# Altium schematic sheet CartePuissance.SchDoc
size A4 portrait; PageSetup: Record=PageOptions|CenterHorizontal=True|CenterVertical=True|PrintScale=1.00|XCorrection=1.00|YCorrection=1.00|PrintKind=1|BorderSize=5000000|LeftOffset=0|BottomOffset=0|Orientation=1|PaperLength=1000|PaperWidth=1000|Scale=100|PaperSource=7|PrintQuality=-4|MediaType=1|DitherType=10|PaperKind=A3|PrintScaleMode=1
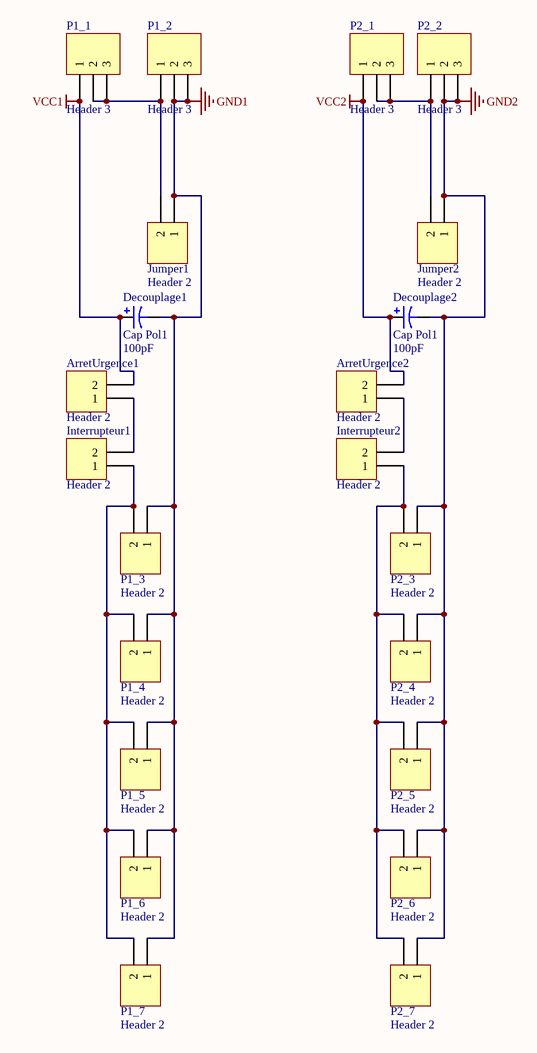
[diagram p0: CartePuissance.SchDoc]

## Parts
ArretUrgence1  Header 2  [HDR1X2]
ArretUrgence2  Header 2  [HDR1X2]
Decouplage1  Cap Pol1  value 100pF  [RB7.6-15]
Decouplage2  Cap Pol1  value 100pF  [RB7.6-15]
Interrupteur1  Header 2  [HDR1X2]
Interrupteur2  Header 2  [HDR1X2]
Jumper1  Header 2  [HDR1X2]
Jumper2  Header 2  [HDR1X2]
P1_1  Header 3  [HDR1X3]
P1_2  Header 3  [HDR1X3]
P1_3  Header 2  [HDR1X2]
P1_4  Header 2  [HDR1X2]
P1_5  Header 2  [HDR1X2]
P1_6  Header 2  [HDR1X2]
P1_7  Header 2  [HDR1X2]
P2_1  Header 3  [HDR1X3]
P2_2  Header 3  [HDR1X3]
P2_3  Header 2  [HDR1X2]
P2_4  Header 2  [HDR1X2]
P2_5  Header 2  [HDR1X2]
P2_6  Header 2  [HDR1X2]
P2_7  Header 2  [HDR1X2]

## Nets
GND1: Decouplage1.2 Jumper1.1 P1_2.2 P1_2.3 P1_3.1 P1_4.1 P1_5.1 P1_6.1 P1_7.1
GND2: Decouplage2.2 Jumper2.1 P2_2.2 P2_2.3 P2_3.1 P2_4.1 P2_5.1 P2_6.1 P2_7.1
VCC1: ArretUrgence1.2 Decouplage1.1 P1_1.1
VCC2: ArretUrgence2.2 Decouplage2.1 P2_1.1
NetArretUrgence1_1: ArretUrgence1.1 Interrupteur1.2
NetArretUrgence2_1: ArretUrgence2.1 Interrupteur2.2
NetInterrupteur1_1: Interrupteur1.1 P1_3.2 P1_4.2 P1_5.2 P1_6.2 P1_7.2
NetInterrupteur2_1: Interrupteur2.1 P2_3.2 P2_4.2 P2_5.2 P2_6.2 P2_7.2
NetJumper1_2: Jumper1.2 P1_1.2 P1_1.3 P1_2.1
NetJumper2_2: Jumper2.2 P2_1.2 P2_1.3 P2_2.1

## Library data of the parts
ArretUrgence1 ArretUrgence2 Interrupteur1 Interrupteur2 Jumper1 Jumper2 P1_3-P1_7 P2_3-P2_7 = Header 2: Header, 2-Pin; LatestRevisionDate: 17-Jul-2002; LatestRevisionNote: Re-released for DXP Platform.; Publisher: Altium Limited
Decouplage1 Decouplage2 = Cap Pol1: Polarized Capacitor (Radial); Published: 8-Jun-2000; LatestRevisionDate: 17-Jul-2002; LatestRevisionNote: Re-released for DXP Platform.; PackageReference: RB7.6-15; Publisher: Altium Limited; PackageDescription: Polarized Capacitor (Radial); 2 Leads
P1_1 P1_2 P2_1 P2_2 = Header 3: Header, 3-Pin; LatestRevisionDate: 17-Jul-2002; LatestRevisionNote: Re-released for DXP Platform.; Publisher: Altium Limited